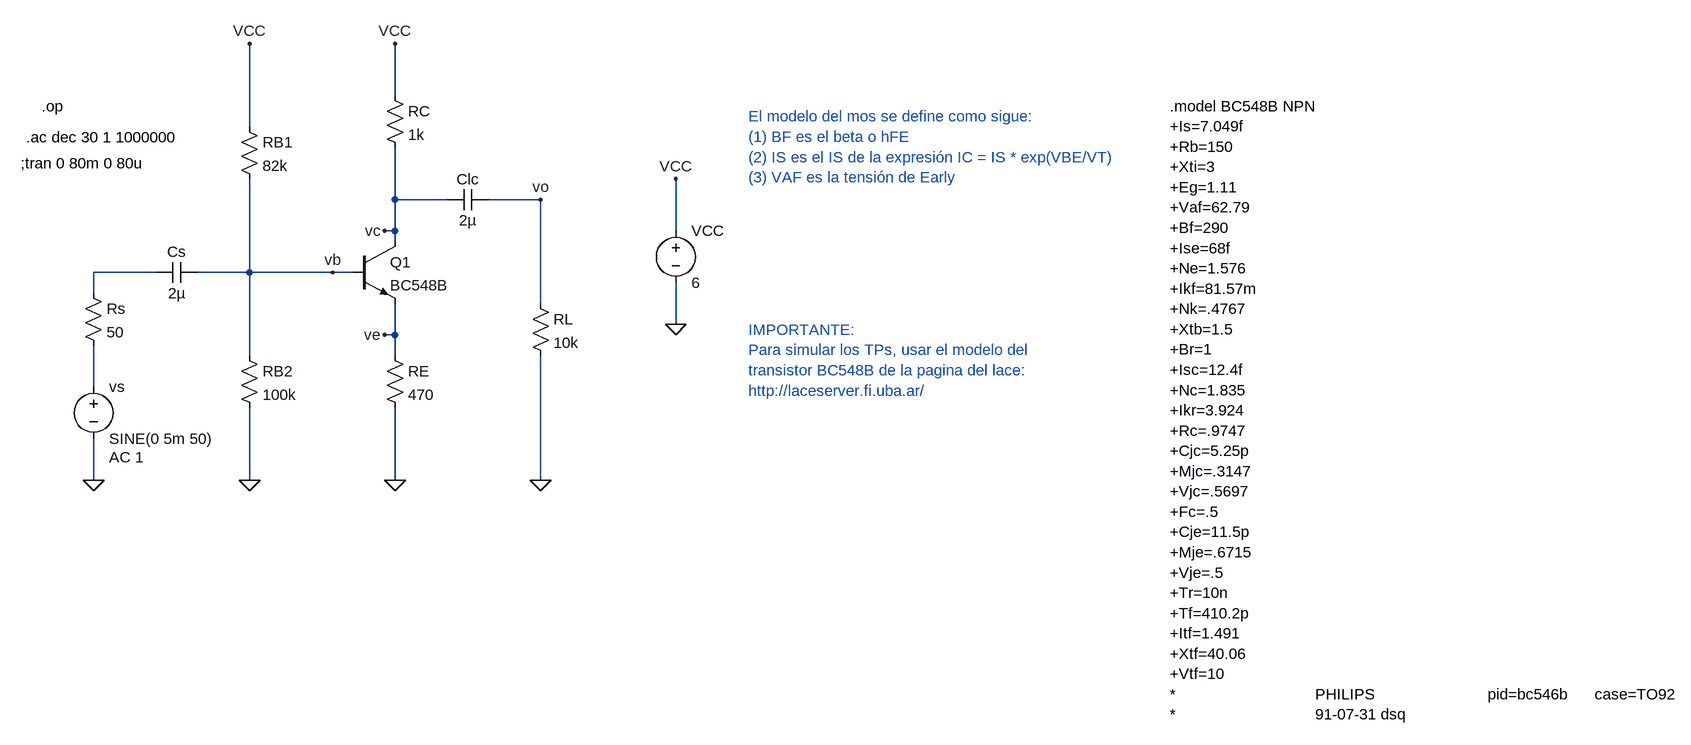
[diagram p0: schematic NPN.asc]
NPN.asc, the LTspice schematic file:
Version 4
SHEET 1 1900 872
WIRE -112 -176 -112 -256
WIRE -336 -128 -336 -256
WIRE -112 -16 -112 -96
WIRE -32 -16 -112 -16
WIRE 112 -16 32 -16
WIRE -112 32 -112 -16
WIRE -112 32 -128 32
WIRE 320 32 320 -48
WIRE -112 48 -112 32
WIRE -480 96 -576 96
WIRE -336 96 -336 -48
WIRE -336 96 -416 96
WIRE -208 96 -336 96
WIRE -176 96 -208 96
WIRE -576 128 -576 96
WIRE 112 144 112 -16
WIRE 320 176 320 112
WIRE -112 192 -112 144
WIRE -112 192 -128 192
WIRE -336 224 -336 96
WIRE -112 224 -112 192
WIRE -576 272 -576 208
WIRE -576 416 -576 352
WIRE -336 416 -336 304
WIRE -112 416 -112 304
WIRE 112 416 112 224
FLAG -208 96 vb
FLAG -128 32 vc
FLAG -128 192 ve
FLAG -112 416 0
FLAG -336 416 0
FLAG 112 416 0
FLAG 320 176 0
FLAG 320 -48 VCC
FLAG -112 -256 VCC
FLAG -336 -256 VCC
FLAG -576 416 0
FLAG 112 -16 vo
SYMBOL npn -176 48 R0
SYMATTR InstName Q1
SYMATTR Value BC548B
SYMBOL res -128 208 R0
SYMATTR InstName RE
SYMATTR Value 470
SYMBOL res -128 -192 R0
SYMATTR InstName RC
SYMATTR Value 1k
SYMBOL res -352 208 R0
SYMATTR InstName RB2
SYMATTR Value 100k
SYMBOL res -352 -144 R0
SYMATTR InstName RB1
SYMATTR Value 82k
SYMBOL cap 32 -32 R90
WINDOW 0 0 32 VBottom 2
WINDOW 3 32 32 VTop 2
SYMATTR InstName Clc
SYMATTR Value 2µ
SYMBOL res 96 128 R0
SYMATTR InstName RL
SYMATTR Value 10k
SYMBOL voltage 320 16 R0
SYMATTR InstName VCC
SYMATTR Value 6
SYMBOL cap -416 80 R90
WINDOW 0 0 32 VBottom 2
WINDOW 3 32 32 VTop 2
SYMATTR InstName Cs
SYMATTR Value 2µ
SYMBOL voltage -576 256 R0
WINDOW 123 24 124 Left 2
WINDOW 39 0 0 Left 0
SYMATTR Value2 AC 1
SYMATTR InstName vs
SYMATTR Value SINE(0 5m 50)
SYMBOL res -592 112 R0
SYMATTR InstName Rs
SYMATTR Value 50
TEXT 1080 -160 Left 2 !.model BC548B NPN\n+Is=7.049f\n+Rb=150\n+Xti=3\n+Eg=1.11\n+Vaf=62.79\n+Bf=290\n+Ise=68f\n+Ne=1.576\n+Ikf=81.57m\n+Nk=.4767\n+Xtb=1.5\n+Br=1\n+Isc=12.4f\n+Nc=1.835\n+Ikr=3.924\n+Rc=.9747\n+Cjc=5.25p\n+Mjc=.3147\n+Vjc=.5697\n+Fc=.5\n+Cje=11.5p\n+Mje=.6715\n+Vje=.5\n+Tr=10n\n+Tf=410.2p\n+Itf=1.491\n+Xtf=40.06\n+Vtf=10\n*                               PHILIPS                         pid=bc546b      case=TO92\n*                               91-07-31 dsq
TEXT 432 -144 Left 2 ;El modelo del mos se define como sigue:\n(1) BF es el beta o hFE\n(2) IS es el IS de la expresión IC = IS * exp(VBE/VT)\n(3) VAF es la tensión de Early
TEXT 432 184 Left 2 ;IMPORTANTE:\nPara simular los TPs, usar el modelo del \ntransistor BC548B de la pagina del lace:\nhttp://laceserver.fi.uba.ar/
TEXT -688 -72 Left 2 !;tran 0 80m 0 80u
TEXT -680 -112 Left 2 !.ac dec 30 1 1000000
TEXT -656 -160 Left 2 !.op

The netlist it stands for:
* NPN.asc
Q1 vc vb ve 0 BC548B
RE ve 0 470
RC VCC vc 1k
RB2 vb 0 100k
RB1 VCC vb 82k
Clc vo vc 2µ
RL vo 0 10k
VCC VCC 0 6
Cs vb N001 2µ
vs N002 0 SINE(0 5m 50) AC 1
Rs N001 N002 50
.model NPN NPN
.model PNP PNP
.lib standard.bjt
.model BC548B NPN
+Is=7.049f
+Rb=150
+Xti=3
+Eg=1.11
+Vaf=62.79
+Bf=290
+Ise=68f
+Ne=1.576
+Ikf=81.57m
+Nk=.4767
+Xtb=1.5
+Br=1
+Isc=12.4f
+Nc=1.835
+Ikr=3.924
+Rc=.9747
+Cjc=5.25p
+Mjc=.3147
+Vjc=.5697
+Fc=.5
+Cje=11.5p
+Mje=.6715
+Vje=.5
+Tr=10n
+Tf=410.2p
+Itf=1.491
+Xtf=40.06
+Vtf=10
*                               PHILIPS                         pid=bc546b      case=TO92
*                               91-07-31 dsq
* El modelo del mos se define como sigue:
* (1) BF es el beta o hFE
* (2) IS es el IS de la expresión IC = IS * exp(VBE/VT)
* (3) VAF es la tensión de Early
* IMPORTANTE:
* Para simular los TPs, usar el modelo del
* transistor BC548B de la pagina del lace:
* http://laceserver.fi.uba.ar/
;tran 0 80m 0 80u
.ac dec 30 1 1000000
.op
.backanno
.end